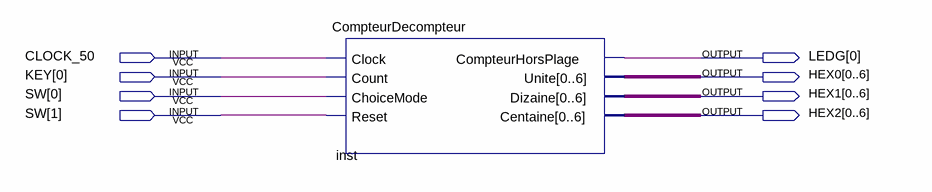
[diagram p0: schematic sheet]
// Quartus schematic CompteurDecompteurDE2115.bdf as structural Verilog: 1 symbols, 8 pins
module CompteurDecompteurDE2115 (
  input  CLOCK_50,
  input  [0:0] KEY,
  input  [1:0] SW,
  output [0:0] LEDG,
  output [0:6] HEX0,
  output [0:6] HEX1,
  output [0:6] HEX2
);

  CompteurDecompteur inst (
    .Clock(CLOCK_50), .Count(KEY[0]), .ChoiceMode(SW[0]), .Reset(SW[1]), .CompteurHorsPlage(LEDG[0]),
    .Unite(HEX0), .Dizaine(HEX1), .Centaine(HEX2));
endmodule
